# Altium schematic sheet MCU.SchDoc
size A3
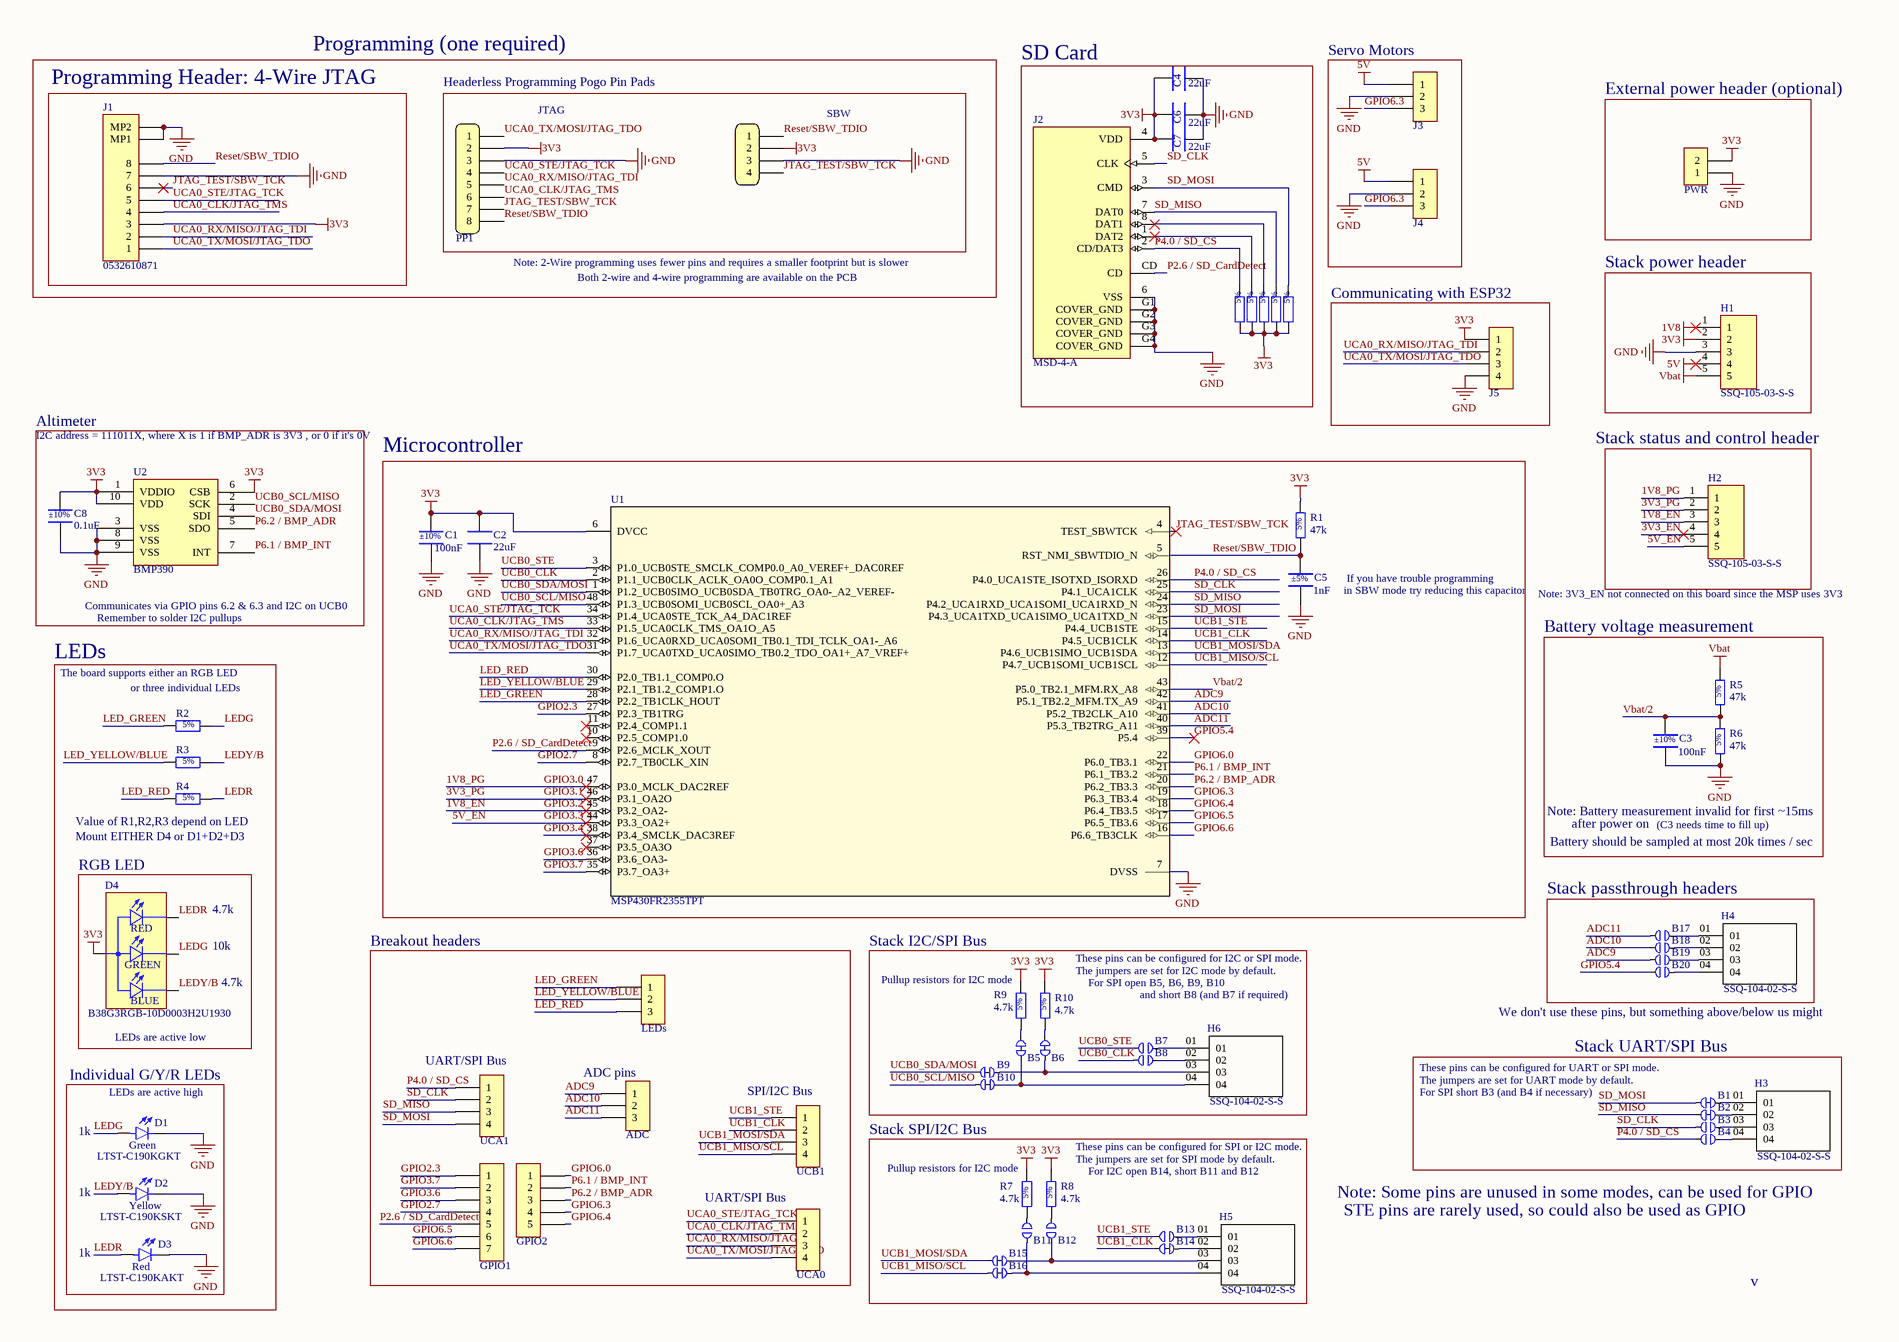
[diagram p0: MCU.SchDoc, left]
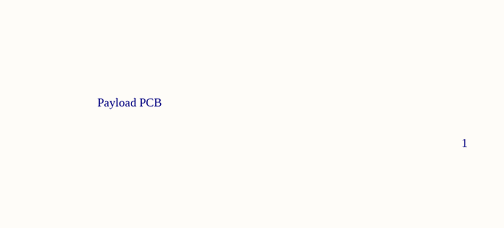
[diagram p1: MCU.SchDoc, right]

## Parts
ADC  HDR,2.54mm,1x3  [HEADER_2.54MM_1x3PIN]  (value not drawn)  (no BOM)
B1  Solder Jumper Normally Closed 0201  [Solder Bridge Closed 0201]  (value not drawn)  (net tie, no BOM)
B2  Solder Jumper Normally Closed 0201  [Solder Bridge Closed 0201]  (value not drawn)  (net tie, no BOM)
B3  Solder Jumper Normally Open 0201  [Solder Bridge Open 0201]  (value not drawn)  (no BOM)
B4  Solder Jumper Normally Open 0201  [Solder Bridge Open 0201]  (value not drawn)  (no BOM)
B5  Solder Jumper Normally Closed 0201  [Solder Bridge Closed 0201]  (value not drawn)  (net tie, no BOM)
B6  Solder Jumper Normally Closed 0201  [Solder Bridge Closed 0201]  (value not drawn)  (net tie, no BOM)
B7  Solder Jumper Normally Open 0201  [Solder Bridge Open 0201]  (value not drawn)  (no BOM)
B8  Solder Jumper Normally Open 0201  [Solder Bridge Open 0201]  (value not drawn)  (no BOM)
B9  Solder Jumper Normally Closed 0201  [Solder Bridge Closed 0201]  (value not drawn)  (net tie, no BOM)
B10  Solder Jumper Normally Closed 0201  [Solder Bridge Closed 0201]  (value not drawn)  (net tie, no BOM)
B11  Solder Jumper Normally Open 0201  [Solder Bridge Open 0201]  (value not drawn)  (no BOM)
B12  Solder Jumper Normally Open 0201  [Solder Bridge Open 0201]  (value not drawn)  (no BOM)
B13  Solder Jumper Normally Open 0201  [Solder Bridge Open 0201]  (value not drawn)  (no BOM)
B14  Solder Jumper Normally Closed 0201  [Solder Bridge Closed 0201]  (value not drawn)  (net tie, no BOM)
B15  Solder Jumper Normally Closed 0201  [Solder Bridge Closed 0201]  (value not drawn)  (net tie, no BOM)
B16  Solder Jumper Normally Closed 0201  [Solder Bridge Closed 0201]  (value not drawn)  (net tie, no BOM)
B17  Solder Jumper Normally Open 0201  [Solder Bridge Open 0201]  (value not drawn)  (no BOM)
B18  Solder Jumper Normally Open 0201  [Solder Bridge Open 0201]  (value not drawn)  (no BOM)
B19  Solder Jumper Normally Open 0201  [Solder Bridge Open 0201]  (value not drawn)  (no BOM)
B20  Solder Jumper Normally Open 0201  [Solder Bridge Open 0201]  (value not drawn)  (no BOM)
C1  100nF  [CAPACITOR_0805_2012M-70N]
C2  22uF  [CAPACITOR_0805_2012M-70N]
C3  100nF  [CAPACITOR_0805_2012M-70N]
C4  22uF  [CAPACITOR_0805_2012M-70N]
C5  1nF  [CAPACITOR_0805_2012M-70N]
C6  22uF  [CAPACITOR_0805_2012M-70N]
C7  22uF  [CAPACITOR_0805_2012M-70N]
C8  0.1uF  [CAPACITOR_0805_2012M-70N]
D1  MF Part No.: LTST-C190KGKT  Colour: Green  [LED_0603_1608M_0.80mm]  (hidden comment: LTST-C190 Series)
D2  MF Part No.: LTST-C190KSKT  Colour: Yellow  [LED_0603_1608M_0.80mm]  (hidden comment: LTST-C190 Series)
D3  MF Part No.: LTST-C190KAKT  Colour: Red  [LED_0603_1608M_0.80mm]  (hidden comment: LTST-C190 Series)
D4  B38G3RGB-10D0003H2U1930  [LED_B38G3RGB-10D0003H2U1930_0606_1616M]
GPIO1  HDR,2.54mm,1x7  [HEADER_2.54MM_1x7PIN]  (value not drawn)  (no BOM)
GPIO2  HDR,2.54mm,1x5  [HEADER_2.54MM_1x5PIN]  (value not drawn)  (no BOM)
H1  SSQ-105-03-S-S  [SAMTEC_SSQ-105-03-S-S]  (no BOM)
H2  SSQ-105-03-S-S  [SAMTEC_SSQ-105-03-S-S]  (no BOM)
H3  SSQ-104-02-S-S  [*SAMTEC_SSQ-104-02-S-S_SSQ-104-02-S-S(Primary)]  (no BOM)
H4  SSQ-104-02-S-S  [*SAMTEC_SSQ-104-02-S-S_SSQ-104-02-S-S(Primary)]  (no BOM)
H5  SSQ-104-02-S-S  [*SAMTEC_SSQ-104-02-S-S_SSQ-104-02-S-S(Primary)]  (no BOM)
H6  SSQ-104-02-S-S  [*SAMTEC_SSQ-104-02-S-S_SSQ-104-02-S-S(Primary)]  (no BOM)
J1  0532610871  [MOLEX_0532610871]
J2  MSD-4-A  [CUI_MSD-4-A]
J3  0530480310  [MOLEX_0530480310]  (value not drawn)
J4  0530480310  [MOLEX_0530480310]  (value not drawn)
J5  0530480410  [MOLEX_0530480410]  (value not drawn)
LEDs  HDR,2.54mm,1x3  [HEADER_2.54MM_1x3PIN]  (value not drawn)  (no BOM)
PP1  Headerless Pogo Holes 8-pin  [POGO_8_PIN_HEADER]  (value not drawn)  (no BOM)
PP2  Headerless Pogo Holes 4-pin  [POGO_4_PIN_HEADER]  (value not drawn)  (no BOM)
PWR  HDR,2.54mm,1x2  [HEADER_2.54MM_1x2PIN]  (value not drawn)  (no BOM)
R1  47k  [Resistor_0805_2012M-50N]
R2  1k  [Resistor_0805_2012M-50N]  (value not drawn)
R3  1k  [Resistor_0805_2012M-50N]  (value not drawn)
R4  1k  [Resistor_0805_2012M-50N]  (value not drawn)
R5  47k  [Resistor_0805_2012M-50N]
R6  47k  [Resistor_0805_2012M-50N]
R7  4.7k  [Resistor_0805_2012M-50N]
R8  4.7k  [Resistor_0805_2012M-50N]
R9  4.7k  [Resistor_0805_2012M-50N]
R10  4.7k  [Resistor_0805_2012M-50N]
R11  4.7k  [Resistor_0805_2012M-50N]  (value not drawn)
R12  4.7k  [Resistor_0805_2012M-50N]  (value not drawn)
R13  4.7k  [Resistor_0805_2012M-50N]  (value not drawn)
R14  4.7k  [Resistor_0805_2012M-50N]  (value not drawn)
R15  4.7k  [Resistor_0805_2012M-50N]  (value not drawn)
U1  MSP430FR2355TPT  [PT0048A_L]
U2  BMP390  [BMP390]
UCA0  HDR,2.54mm,1x4  [HEADER_2.54MM_1x4PIN]  (value not drawn)  (no BOM)
UCA1  HDR,2.54mm,1x4  [HEADER_2.54MM_1x4PIN]  (value not drawn)  (no BOM)
UCB1  HDR,2.54mm,1x4  [HEADER_2.54MM_1x4PIN]  (value not drawn)  (no BOM)

## Blocks framed on the sheet
Programming Header: 4-Wire JTAG: J1
Headerless Programming Pogo Pin Pads: PP1 PP2
SD Card: C4 C6 C7 J2 R11-R15
Servo Motors: J3 J4
External power header (optional): PWR
Stack power header: H1
Communicating with ESP32: J5
Altimeter: C8 U2
Microcontroller: C1 C2 C5 R1 U1
Battery voltage measurement: C3 R5 R6
LEDs: R2-R4
RGB LED: D4
Stack passthrough headers: B17-B20 H4
Breakout headers: ADC GPIO1 GPIO2 LEDs UCA0 UCA1 UCB1
Stack I2C/SPI Bus: B5-B10 H6 R9 R10
Stack UART/SPI Bus: B1-B4 H3
Individual G/Y/R LEDs: D1-D3
Stack SPI/I2C Bus: B11-B16 H5 R7 R8

## Nets
1V8: H1.1
3V3: C1.2 C2.2 C4.2 C6.2 C7.2 C8.2 D4.3(A) H1.2 J1.3 J2.4(VDD) J5.1 PP1.2 PP2.2 PWR.2 R1.2 R7.2 R8.2 R9.2 R10.2 R11.2 R12.2 R13.2 R14.2 R15.2 U1.6(DVCC) U2.1(VDDIO) U2.6(CSB) U2.10(VDD)
5V: H1.4 J3.1 J4.1
GND: C1.1 C2.1 C3.1 C4.1 C5.1 C6.1 C7.1 C8.1 D1.C D2.C D3.C H1.3 J1.7 J1.MP1 J1.MP2 J2.6(VSS) J2.G1(COVER_GND) J2.G2(COVER_GND) J2.G3(COVER_GND) J2.G4(COVER_GND) J3.2 J4.2 J5.4 PP1.3 PP2.3 PWR.1 R6.1 U1.7(DVSS) U2.3(VSS) U2.8(VSS) U2.9(VSS)
Vbat: H1.5 R5.2
1V8_EN: H2.3 U1.45(P3.2_OA2-)  [also labelled GPIO3.2]
1V8_PG: H2.1 U1.47(P3.0_MCLK_DAC2REF)  [also labelled GPIO3.0]
3V3_EN: H2.4
3V3_PG: H2.2 U1.46(P3.1_OA2O)  [also labelled GPIO3.1]
5V_EN: H2.5 U1.44(P3.3_OA2+)  [also labelled GPIO3.3]
ADC9: ADC.1 B19.1 U1.42(P5.1_TB2.2_MFM.TX_A9)
ADC10: ADC.2 B18.1 U1.41(P5.2_TB2CLK_A10)
ADC11: ADC.3 B17.1 U1.40(P5.3_TB2TRG_A11)
GPIO2.3: GPIO1.1 U1.27(P2.3_TB1TRG)
GPIO2.7: GPIO1.4 U1.8(P2.7_TB0CLK_XIN)
GPIO3.4: U1.38(P3.4_SMCLK_DAC3REF)
GPIO3.6: GPIO1.3 U1.36(P3.6_OA3-)
GPIO3.7: GPIO1.2 U1.35(P3.7_OA3+)
GPIO5.4: B20.1 U1.39(P5.4)
GPIO6.0: GPIO2.1 U1.22(P6.0_TB3.1)
GPIO6.3: GPIO2.4 J3.3 J4.3 U1.19(P6.3_TB3.4)
GPIO6.4: GPIO2.5 U1.18(P6.4_TB3.5)
GPIO6.5: GPIO1.6 U1.17(P6.5_TB3.6)
GPIO6.6: GPIO1.7 U1.16(P6.6_TB3CLK)
JTAG_TEST/SBW_TCK: J1.6 PP1.7 PP2.4 U1.4(TEST_SBWTCK)
LED_GREEN: LEDs.1 R2.1 U1.28(P2.2_TB1CLK_HOUT)
LED_RED: LEDs.3 R4.1 U1.30(P2.0_TB1.1_COMP0.O)
LED_YELLOW/BLUE: LEDs.2 R3.1 U1.29(P2.1_TB1.2_COMP1.O)
LEDG: D1.A D4.1(G_C) R2.2
LEDR: D3.A D4.4(R_C) R4.2
LEDY/B: D2.A D4.2(B_C) R3.2
P2.6 / SD_CardDetect: GPIO1.5 J2.CD U1.9(P2.6_MCLK_XOUT)
P4.0 / SD_CS: B4.1 J2.2(CD/DAT3) R11.1 U1.26(P4.0_UCA1STE_ISOTXD_ISORXD) UCA1.1
P6.1 / BMP_INT: GPIO2.2 U1.21(P6.1_TB3.2) U2.7(INT)
P6.2 / BMP_ADR: GPIO2.3 U1.20(P6.2_TB3.3) U2.5(SDO)
Reset/SBW_TDIO: C5.2 J1.8 PP1.8 PP2.1 R1.1 U1.5(RST_NMI_SBWTDIO_N)
SD_CLK: B3.1 J2.5(CLK) U1.25(P4.1_UCA1CLK) UCA1.2
SD_MISO: B2.1 J2.7(DAT0) R14.1 U1.24(P4.2_UCA1RXD_UCA1SOMI_UCA1RXD_N) UCA1.3
SD_MOSI: B1.1 J2.3(CMD) R15.1 U1.23(P4.3_UCA1TXD_UCA1SIMO_UCA1TXD_N) UCA1.4
UCA0_CLK/JTAG_TMS: J1.4 PP1.6 U1.33(P1.5_UCA0CLK_TMS_OA1O_A5) UCA0.2
UCA0_RX/MISO/JTAG_TDI: J1.2 J5.2 PP1.5 U1.32(P1.6_UCA0RXD_UCA0SOMI_TB0.1_TDI_TCLK_OA1-_A6) UCA0.3
UCA0_STE/JTAG_TCK: J1.5 PP1.4 U1.34(P1.4_UCA0STE_TCK_A4_DAC1REF) UCA0.1
UCA0_TX/MOSI/JTAG_TDO: J1.1 J5.3 PP1.1 U1.31(P1.7_UCA0TXD_UCA0SIMO_TB0.2_TDO_OA1+_A7_VREF+) UCA0.4
UCB0_CLK: B8.2 U1.2(P1.1_UCB0CLK_ACLK_OA0O_COMP0.1_A1)
UCB0_SCL/MISO: B10.1 U1.48(P1.3_UCB0SOMI_UCB0SCL_OA0+_A3) U2.2(SCK)
UCB0_SDA/MOSI: B9.2 U1.1(P1.2_UCB0SIMO_UCB0SDA_TB0TRG_OA0-_A2_VEREF-) U2.4(SDI)
UCB0_STE: B7.2 U1.3(P1.0_UCB0STE_SMCLK_COMP0.0_A0_VEREF+_DAC0REF)
UCB1_CLK: B14.1 U1.14(P4.5_UCB1CLK) UCB1.2
UCB1_MISO/SCL: B16.1 U1.12(P4.7_UCB1SOMI_UCB1SCL) UCB1.4
UCB1_MOSI/SDA: B15.1 U1.13(P4.6_UCB1SIMO_UCB1SDA) UCB1.3
UCB1_STE: B13.1 U1.15(P4.4_UCB1STE) UCB1.1
Vbat/2: C3.2 R5.1 R6.2 U1.43(P5.0_TB2.1_MFM.RX_A8)
NetB1_2: B1.2 H3.01
NetB2_2: B2.2 H3.02
NetB3_2: B3.2 H3.03
NetB4_2: B4.2 H3.04
NetB5_1: B5.1 B10.2 H6.04
NetB5_2: B5.2 R9.1
NetB6_1: B6.1 R10.1
NetB6_2: B6.2 B9.1 H6.03
NetB7_1: B7.1 H6.01
NetB8_1: B8.1 H6.02
NetB11_1: B11.1 B16.2 H5.04
NetB11_2: B11.2 R7.1
NetB12_1: B12.1 R8.1
NetB12_2: B12.2 B15.2 H5.03
NetB13_2: B13.2 H5.01
NetB14_2: B14.2 H5.02
NetB17_2: B17.2 H4.01
NetB18_2: B18.2 H4.02
NetB19_2: B19.2 H4.03
NetB20_2: B20.2 H4.04
NetJ2_1: J2.1(DAT2) R12.1
NetJ2_8: J2.8(DAT1) R13.1

Not connected (* = marked no-connect by the designer): U1 10(P2.5_COMP1.0)* 11(P2.4_COMP1.1)* 37(P3.5_OA3O)*

## Notes on the sheet
- Programming (one required)
- JTAG
- SBW
- Note: 2-Wire programming uses fewer pins and requires a smaller footprint but is slower
- Both 2-wire and 4-wire programming are available on the PCB
- I2C address = 111011X, where X is 1 if BMP_ADR is 3V3 , or 0 if it's 0V
- Stack status and control header
- Communicates via GPIO pins 6.2 & 6.3 and I2C on UCB0
- Remember to solder I2C pullups
- in SBW mode try reducing this capacitor
- If you have trouble programming
- (near H2) Note: 3V3_EN not connected on this board since the MSP uses 3V3
- (near R2) The board supports either an RGB LED
- (near R2) or three individual LEDs
- Note: Battery measurement invalid for first ~15ms
- (near R4) Value of R1,R2,R3 depend on LED
- (near R4) Mount EITHER D4 or D1+D2+D3
- Battery should be sampled at most 20k times / sec
- after power on
- (C3 needs time to fill up)
- (near D4) 4.7k
- (near D4) 10k
- 4.7k
- Pullup resistors for I2C mode
- These pins can be configured for I2C or SPI mode.
- (near R10) The jumpers are set for I2C mode by default.
- For SPI open B5, B6, B9, B10
- and short B8 (and B7 if required)
- (near D4) LEDs are active low
- (near UCA1) UART/SPI Bus
- We don't use these pins, but something above/below us might
- (near D1) LEDs are active high
- (near ADC) ADC pins
- (near UCB1) SPI/I2C Bus
- These pins can be configured for UART or SPI mode.
- The jumpers are set for UART mode by default.
- For SPI short B3 (and B4 if necessary)
- (near D1) 1k
- These pins can be configured for SPI or I2C mode.
- (near R8) The jumpers are set for SPI mode by default.
- For I2C open B14, short B11 and B12
- (near D2) 1k
- (near UCA0) UART/SPI Bus
- Note: Some pins are unused in some modes, can be used for GPIO
- STE pins are rarely used, so could also be used as GPIO
- Payload PCB
- 1k
- v
- 1
- (in symbol B38G3RGB-10D0003H2U1930) RED; GREEN; BLUE

## Library data of the parts
ADC LEDs = HDR,2.54mm,1x3: Connector - 2.54mm, 1x3-pin
C1 C3 C8 = Generic Capacitor: MF Part No.: C0805C104K5RAC7800; Tolerance: ±10%; Temperature Coefficient: X7R; Rated Voltage: 50V; Capacitance at Rated Voltage: 40%; Temp Range: -55°C ~ 125°C; Supplier 1: Digikey; Supplier 1 Part No.: 399-C0805C104K5RAC7800CT-ND; Package: 0805
  C1 C3: Value: 100nF
  C8: Value: 0.1uF
C2 = C0805C226M9PACTU: Passive - Capacitor, X5R, 22uF Max, 6.3V, 0805 (2012 Metric), ±20%, -55°C ~ 85°C. 8.8uF @ 5V; APSS Standard Part: APSS Standard; Capacitance at Rated Voltage: 30%; Tolerance: ±20%; Temperature Coefficient: X5R; Rated Voltage: 6.3V; Temp Range: -55°C ~ 85°C; Package: 0402; Supplier 1: Digikey; Supplier 1 Part No.: 399-C0805C226M9PAC7800CT-ND; MF Part No.: C0805C226M9PACTU; Value: 22uF
C4 C6 C7 = GRM21BR61C226ME44L: Passive - Capacitor, X5R, 22uF Max, 16V, 0805 (2012 Metric), ±20%, -55°C ~ 85°C. 9.4uF @ 5V, 3.2uF @ 15V, 1.9uF @ 25V; APSS Standard Part: APSS Standard; Capacitance at Rated Voltage: 10%; Tolerance: ±20%; Temperature Coefficient: X5R; Rated Voltage: 16V; Temp Range: -55°C ~ 85°C; Package: 0805; Supplier 1: Digikey; Supplier 1 Part No.: 490-10747-1-ND; MF Part No.: GRM21BR61C226ME44L; Value: 22uF
C5 = Generic Capacitor: MF Part No.: 399-C0805C102J5GAC7800CT-ND; Tolerance: ±5%; Temperature Coefficient: X7R; Rated Voltage: 50V; Capacitance at Rated Voltage: 100%; Temp Range: -55°C ~ 125°C; Supplier 1: Digikey; Supplier 1 Part No.: 399-C0805C102J5GAC7800CT-ND; Package: 0805; Value: 1nF
D1-D3 = LTST-C190 Series: Diode - LED, 0603; APSS Standard Part: APSS Standard; Temp Range: -30°C ~ 85°C; Rated Voltage: 5V Reverse; Package: 0603; Supplier 1: Digikey
D4 = B38G3RGB-10D0003H2U1930: Diode - LED, RGB, 2V Red, 3V Green, 3V Blue 0606 (1616 Metric); APSS Standard Part: APSS Standard; Temp Range: -40°C ~ 85°C; MF Part No.: B38G3RGB-10D0003H2U1930; Package: 0606; Supplier 1: Digikey; Supplier 1 Part No.: 3147-B38G3RGB-10D0003H2U1930CT-ND
GPIO1 = HDR,2.54mm,1x7: Connector - 2.54mm, 1x7-pin
GPIO2 = HDR,2.54mm,1x5: Connector - 2.54mm, 1x5-pin
J1 = 0532610871: Header - Picoblade 08-pin, SMT, RA; APSS Standard Part: APSS Standard; Pitch: 1.25mm; Mounting Type: Surface Mount; Orientation: Right Angle; Pins: 8; Supplier 1: Digikey; Supplier 1 Part No.: WM7626CT-ND; MF Part No.: 0532610871
J2 = MSD-4-A: Micro SD Card Connector, 9 Positions, Connector and Ejector, Push In, Auto Eject Out, Surface Mount, 1.8 mm Height Above Board, Gold Flash; MF: Same Sky; SnapEDA_Link: https://www.snapeda.com/parts/MSD-4-A/Same+Sky/view-part/?ref=snap; Package: None; Value: *; MP: MSD-4-A; Check_prices: https://www.snapeda.com/parts/MSD-4-A/Same+Sky/view-part/?ref=eda
J3 J4 = 0530480310: Header - Picoblade 03-pin, TH, RA; APSS Standard Part: APSS Standard; Pitch: 1.25mm; Mounting Type: Through-hole; Orientation: Right Angle; MF Part No.: 0530480310; Pins: 3; Supplier 1: Digikey; Supplier 1 Part No.: WM1743-ND
J5 = 0530480410: Header - Picoblade 04-pin, TH, RA; APSS Standard Part: APSS Standard; Pitch: 1.25mm; Mounting Type: Through-hole; Orientation: Right Angle; MF Part No.: 0530480410; Pins: 4; Supplier 1: Digikey; Supplier 1 Part No.: WM1744-ND
PWR = HDR,2.54mm,1x2: Connector - 2.54mm, 1x2-pin
R1 R6 = RMCF0805JT Series: Passive - Resistor Series, 0805, 5%, 100m - 22M, E24, 0.063W, 1/16W, ±200ppm/°C, -55°C ~ 155°C, 0805 (2012 Metric); MF Part No.: RMCF0805JT47K0; APSS Standard Part: APSS Standard; Power: 1/8W; Value Range: 100m ~ 22M; Rated Voltage: 150V; Tolerance: 5%; E Series: E24; Temp Range: -55°C ~ 155°C; Supplier 1: Digikey; Package: 0805; Temperature Coefficient: ±200ppm/°C; Value: 47k
R2-R4 R11-R15 = RMCF0805JT Series: Passive - Resistor Series, 0805, 5%, 100m - 22M, E24, 0.063W, 1/16W, ±200ppm/°C, -55°C ~ 155°C, 0805 (2012 Metric); MF Part No.: RMCF0805JT1K00; APSS Standard Part: APSS Standard; Power: 1/8W; Value Range: 100m ~ 22M; Rated Voltage: 150V; Tolerance: 5%; E Series: E24; Temp Range: -55°C ~ 155°C; Supplier 1: Digikey; Package: 0805; Temperature Coefficient: ±200ppm/°C
  R2-R4: Value: 1k
  R11-R15: Value: 4.7k
R5 = RMCF0805JT Series: Passive - Resistor Series, 0805, 5%, 100m - 22M, E24, 0.063W, 1/16W, ±200ppm/°C, -55°C ~ 155°C, 0805 (2012 Metric); MF Part No.: RMCF0805JT147K0; APSS Standard Part: APSS Standard; Power: 1/8W; Value Range: 100m ~ 22M; Rated Voltage: 150V; Tolerance: 5%; E Series: E24; Temp Range: -55°C ~ 155°C; Supplier 1: Digikey; Package: 0805; Temperature Coefficient: ±200ppm/°C; Value: 47k
R7-R10 = RMCF0805JT Series: Passive - Resistor Series, 0805, 5%, 100m - 22M, E24, 0.063W, 1/16W, ±200ppm/°C, -55°C ~ 155°C, 0805 (2012 Metric); MF Part No.: RMCF0805JT4K70; APSS Standard Part: APSS Standard; Power: 1/8W; Value Range: 100m ~ 22M; Rated Voltage: 150V; Tolerance: 5%; E Series: E24; Temp Range: -55°C ~ 155°C; Supplier 1: Digikey; Package: 0805; Temperature Coefficient: ±200ppm/°C; Value: 4.7k
U1 = MSP430FR2355IPT: APSS Standard Part: APSS Standard; Rated Voltage: 1.8V ~ 3.6V; Temp Range: -40°C ~ 105°C (TA); MF Part No.: MSP430FR2355TPT; Package: LQFP-48; Supplier 1: Digikey; Supplier 1 Part No.: 296-50260-ND
U2 = BMP390: Digital Pressure Sensor; APSS Standard Part: APSS Standard; Temp Range: -40°C ~ 85°C; Pressure Range: 30 kPa ~ 125 kPa; Package: LGA; Pins: 10; Supplier 1: Digikey; Supplier 1 Part No.: 828-BMP390CT-ND; Supplier 2: *; Supplier 2 Part No.: *; MF Part No.: BMP390
UCA0 UCA1 UCB1 = HDR,2.54mm,1x4: Connector - 2.54mm, 1x4-pin
B1 B2 B5 B6 B9 B10 B14-B16 = Solder Jumper Normally Closed 0201: DEBUG: DEBUG
B3 B4 B7 B8 B11-B13 B17-B20 = Solder Jumper Normally Open 0201: DEBUG: DEBUG
H1 H2 = SSQ-105-03-S-S: MP: SSQ-105-03-S-S